# EAGLE schematic Quadcopter_Motor_Driver_Schematic (EAGLE 9.7.0)
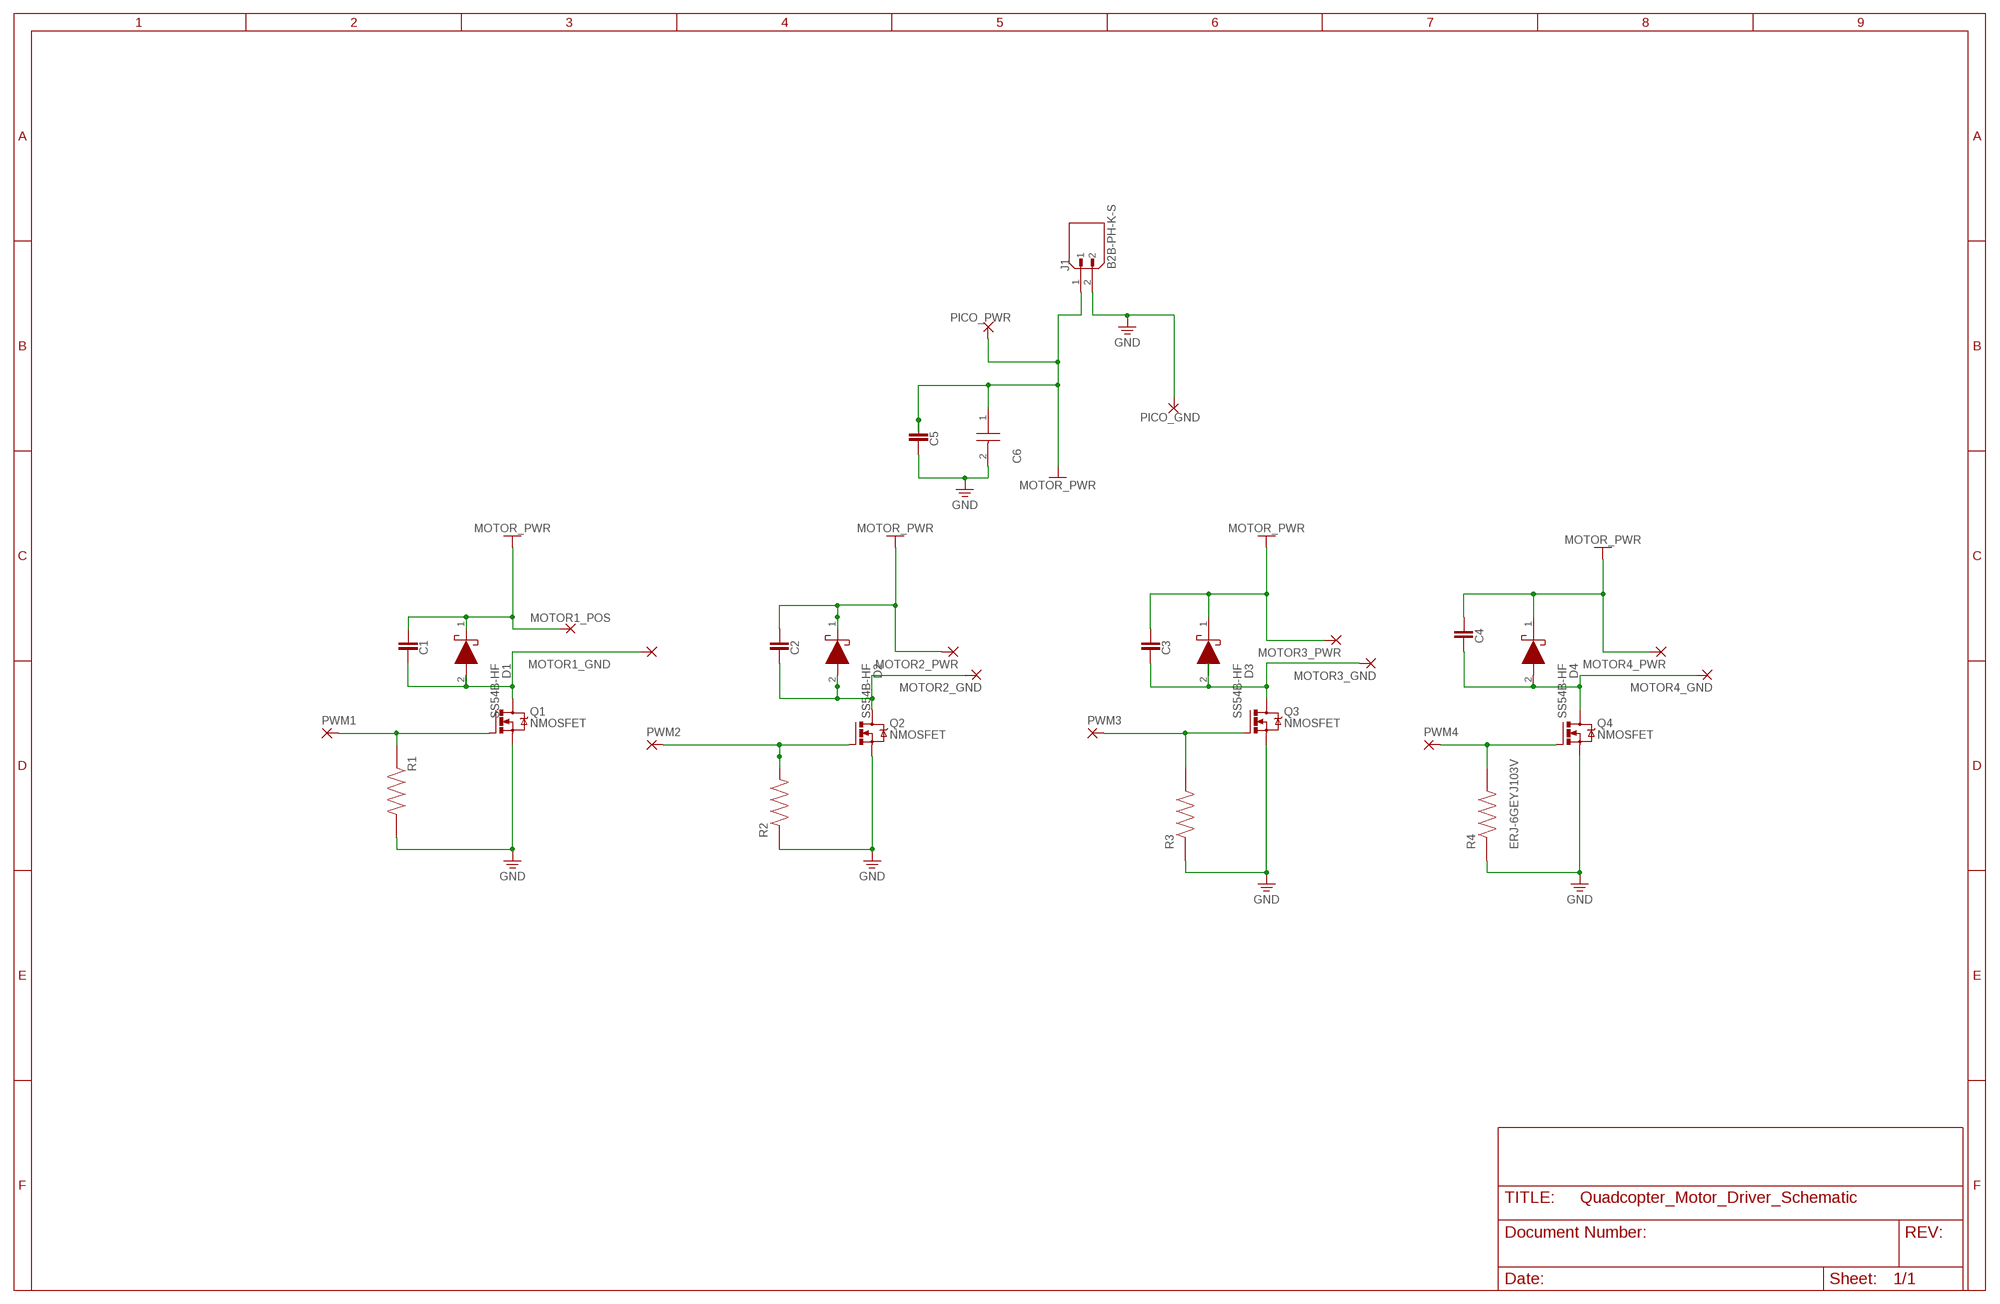
[diagram p0: schematic, sheet 1]

## Parts
C1  CAPACITOR_CHIP-0402(1005-METRIC)  [CAPC1005X60]
C2  CAPACITOR_CHIP-0402(1005-METRIC)  [CAPC1005X60]
C3  CAPACITOR_CHIP-0402(1005-METRIC)  [CAPC1005X60]
C4  CAPACITOR_CHIP-0402(1005-METRIC)  [CAPC1005X60]
C5  CAPACITOR_CHIP-0402(1005-METRIC)  [CAPC1005X60]
C6  REA010M2CBK-0511P  [CAPPRD200W50D525H1250]
D1  SS54B-HF  [DIOM5235X244N]
D2  SS54B-HF  [DIOM5235X244N]
D3  SS54B-HF  [DIOM5235X244N]
D4  SS54B-HF  [DIOM5235X244N]
J1  B2B-PH-K-S  [JST_B2B-PH-K-S]
MOTOR1_GND  1,6/0,8  [1,6/0,8]
MOTOR1_POS  1,6/0,8  [1,6/0,8]
MOTOR2_GND  1,6/0,8  [1,6/0,8]
MOTOR2_PWR  1,6/0,8  [1,6/0,8]
MOTOR3_GND  1,6/0,8  [1,6/0,8]
MOTOR3_PWR  1,6/0,8  [1,6/0,8]
MOTOR4_GND  1,6/0,8  [1,6/0,8]
MOTOR4_PWR  1,6/0,8  [1,6/0,8]
PICO_GND  1,6/0,8  [1,6/0,8]
PICO_PWR  1,6/0,8  [1,6/0,8]
PWM1  1,6/0,8  [1,6/0,8]
PWM2  1,6/0,8  [1,6/0,8]
PWM3  1,6/0,8  [1,6/0,8]
PWM4  1,6/0,8  [1,6/0,8]
Q1  NMOSFET  NMOSFET_SOT23  [SOT23]
Q2  NMOSFET  NMOSFETSOT23-GSD  [SOT23]
Q3  NMOSFET  NMOSFETSOT23-GSD  [SOT23]
Q4  NMOSFET  NMOSFETSOT23-GSD  [SOT23]
R1  ERJ-6GEYJ103V  [RES_ERJ-6GEYJ103V]
R2  ERJ-6GEYJ103V  [RES_ERJ-6GEYJ103V]
R3  ERJ-6GEYJ103V  [RES_ERJ-6GEYJ103V]
R4  ERJ-6GEYJ103V  [RES_ERJ-6GEYJ103V]

## Nets
+V: C1.2 C2.2 C3.2 C4.2 C5.2 C6.1(+) D1.1(K) D2.1(K) D3.1(K) D4.1(K) J1.1 MOTOR1_POS.1(P) MOTOR2_PWR.1(P) MOTOR3_PWR.1(P) MOTOR4_PWR.1(P) PICO_PWR.1(P) ; supply symbol labelled MOTOR_PWR
GND: C5.1 C6.2(-) J1.2 PICO_GND.1(P) Q1.2(S) Q2.2(S) Q3.2(S) Q4.2(S) R1.2 R2.1 R3.1 R4.1
N$1: C1.1 D1.2(A) MOTOR1_GND.1(P) Q1.3(D)
N$2: PWM2.1(P) Q2.1(G) R2.2
N$3: PWM1.1(P) Q1.1(G) R1.1
N$4: C3.1 D3.2(A) MOTOR3_GND.1(P) Q3.3(D)
N$5: C2.1 D2.2(A) MOTOR2_GND.1(P) Q2.3(D)
N$6: PWM4.1(P) Q4.1(G) R4.2
N$8: C4.1 D4.2(A) MOTOR4_GND.1(P) Q4.3(D)
N$12: PWM3.1(P) Q3.1(G) R3.2

## Library data of the parts
C1-C5 = Tinkercad:CAPACITOR: Capacitor - Generic; CATEGORY: Capacitor
C6 = REA010M2CBK-0511P:REA010M2CBK-0511P: Aluminum Electrolytic Capacitors - Radial Leaded 160V 1.0uF 20% 5x11mm Source: Datasheet <https://componentsearchengine.com/Datasheets/1/REA010M2CBK-0511P.pdf>; DESCRIPTION: Aluminum Electrolytic Capacitors - Radial Leaded 160V 1.0uF 20% 5x11mm; HEIGHT: 12.5mm; MANUFACTURER_NAME: Lelon; MANUFACTURER_PART_NUMBER: REA010M2CBK-0511P; MOUSER_PART_NUMBER: 140-REA1R0M2CBK0511P; MOUSER_PRICE-STOCK: https://www.mouser.co.uk/ProductDetail/Lelon/REA010M2CBK-0511P?qs=tsfqLUzc7IoVZpITlkTcwQ%3D%3D
D1-D4 = SS54B-HF:SS54B-HF: Schottky Diodes & Rectifiers DIODE SCHOTTKY 5A 40V SMB Source: Datasheet <https://4donline.ihs.com/images/VipMasterIC/IC/COMC/COMC-S-A0008954161/COMC-S-A0008954161-1.pdf?hkey=EF798316E3902B6ED9A73243A3159BB0>; DESCRIPTION: Schottky Diodes & Rectifiers DIODE SCHOTTKY 5A 40V SMB; HEIGHT: 2.44mm; MANUFACTURER_NAME: Comchip Technology; MANUFACTURER_PART_NUMBER: SS54B-HF; MOUSER_PART_NUMBER: 750-SS54B-HF; MOUSER_PRICE-STOCK: https://www.mouser.co.uk/ProductDetail/Comchip-Technology/SS54B-HF?qs=GBLSl2AkirtlOFqvTyWKug%3D%3D
J1 = B2B-PH-K-S:B2B-PH-K-S; MANUFACTURER: JST
MOTOR1_GND MOTOR1_POS MOTOR2_GND MOTOR2_PWR MOTOR3_GND MOTOR3_PWR MOTOR4_GND MOTOR4_PWR PICO_GND PICO_PWR PWM1-PWM4 = wirepad:1,6/0,8: THROUGH-HOLE PAD
Q1 = Tinkercad:NMOSFET: N-Channel MOSFET - Generic; CATEGORY: Transistor; SUB-CATEGORY: MOSFET; TYPE: N-Channel
Q2-Q4 = Transistor:NMOSFET: N-Channel MOSFET - Generic; CATEGORY: Transistor; SUB-CATEGORY: MOSFET; TYPE: N-Channel
R1-R4 = ERJ-6GEYJ103V:ERJ-6GEYJ103V; MANUFACTURER: Panasonic; MAXIMUM_PACKAGE_HEIGHT: 0.55 mm; PARTREV: 3/1/2020; STANDARD: Manufacturer Recommendations